# EAGLE schematic untitled (EAGLE 7.2.0)
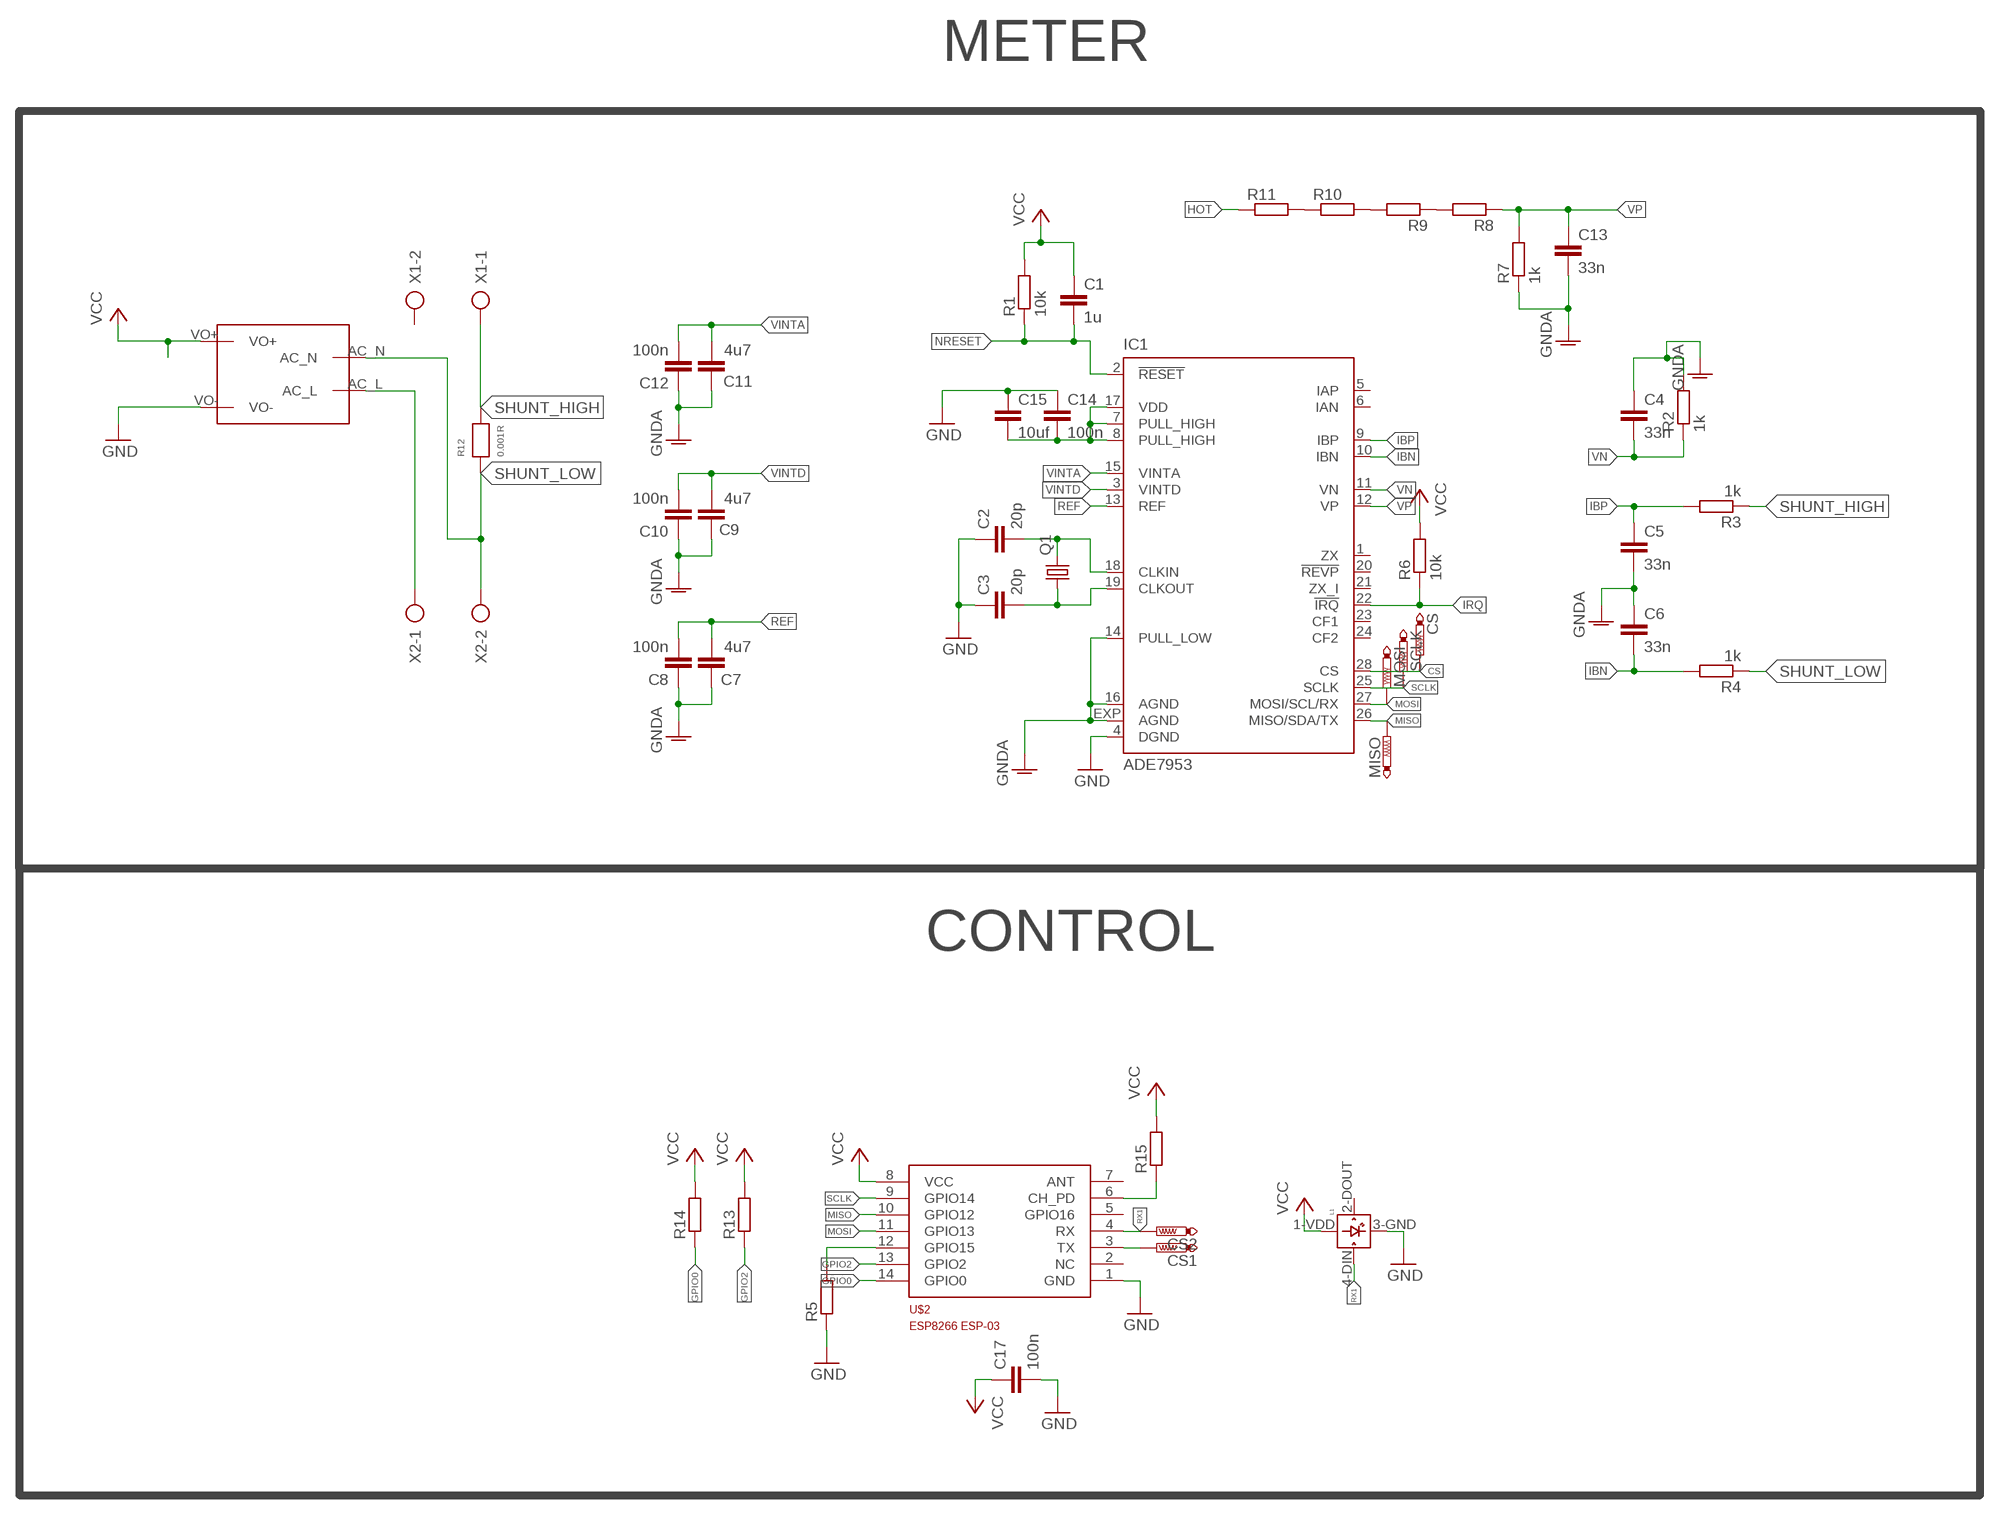
[diagram p0: schematic, sheet 1]

## Parts
C1  1u  C-EUC0805  [C0805]
C2  20p  C-EUC0805  [C0805]
C3  20p  C-EUC0805  [C0805]
C4  33n  C-EUC0805  [C0805]
C5  33n  C-EUC0805  [C0805]
C6  33n  C-EUC0805  [C0805]
C7  4u7  C-EUC0805  [C0805]
C8  100n  C-EUC0805  [C0805]
C9  4u7  C-EUC0805  [C0805]
C10  100n  C-EUC0805  [C0805]
C11  4u7  C-EUC0805  [C0805]
C12  100n  C-EUC0805  [C0805]
C13  33n  C-EUC0805  [C0805]
C14  100n  C-EUC0805  [C0805]
C15  10uf  C-EUC0805  [C0805]
C17  100n  C-EUC0805  [C0805]
CS  PTR1B1,27  [B1,27]
CS1  PTR1B1,27  [B1,27]
CS2  PTR1B1,27  [B1,27]
IC1  ADE7953  [QFN28-ML]
L1  WS2812B  [WS2812B]
MISO  PTR1B1,27  [B1,27]
MOSI  PTR1B1,27  [B1,27]
Q1  CRYSTALHC49UP  [HC49UP]
R1  10k  R-EU_R0805  [R0805]
R2  1k  R-EU_R0805  [R0805]
R3  1k  R-EU_R0805  [R0805]
R4  1k  R-EU_R0805  [R0805]
R5  R-EU_R0603  [R0603]
R6  10k  R-EU_R0805  [R0805]
R7  1k  R-EU_R0805  [R0805]
R8  R-EU_R0805  [R0805]
R9  R-EU_R0805  [R0805]
R10  R-EU_R1206  [R1206]
R11  R-EU_R1206  [R1206]
R12  0.001R  WSR-2_SHUNT  [WRS-2_4527]
R13  R-EU_R0603  [R0603]
R14  R-EU_R0603  [R0603]
R15  R-EU_R0603  [R0603]
SCLK  PTR1B1,27  [B1,27]
U$1  MAINS_CONVERTERS  [HLK-PM01]
U$2  ESP8266_ESP-03  [ESP-03]
X1  AK300/2  [AK300/2]
X2  AK300/2  [AK300/2]

## Nets
CLKIN: C2.2 IC1.18(CLKIN) Q1.2
CLKOUT: C3.2 IC1.19(CLKOUT) Q1.1
CS: CS.TP IC1.28(CS) R5.2 U$2.12(GPIO15)
GND: C2.1 C3.1 C14.1 C15.1 C17.2 IC1.4(DGND) L1.3-GND(GND) R5.1 U$1.VO- U$2.1(GND)
GNDA: C4.1 C5.2 C6.1 C7.1 C8.1 C9.1 C10.1 C11.1 C12.1 C13.2 IC1.14(PULL_LOW) IC1.16(AGND) IC1.EXP(AGND) R2.2 R7.1
GPIO0: R14.1 U$2.14(GPIO0)
GPIO2: R13.1 U$2.13(GPIO2)
HOT: R11.1 U$1.AC_L X2.1
IBN: C6.2 IC1.10(IBN) R4.2
IBP: C5.1 IC1.9(IBP) R3.2
IRQ: IC1.22(!IRQ!) R6.1
MISO: IC1.26(MISO/SDA/TX) MISO.TP U$2.10(GPIO12)
MOSI: IC1.27(MOSI/SCL/RX) MOSI.TP U$2.11(GPIO13)
N$1: R9.2 R10.2
N$2: R10.1 R11.2
N$3: R15.1 U$2.6(CH_PD)
N$12: R8.2 R9.1
NRESET: C1.2 IC1.2(!RESET!) R1.1
REF: C7.2 C8.2 IC1.13(REF)
RX1: CS2.TP L1.4-DIN(DIN) U$2.4(RX)
SCLK: IC1.25(SCLK) SCLK.TP U$2.9(GPIO14)
SHUNT_HIGH: R3.1 R12.2 X1.1
SHUNT_LOW: R4.1 R12.1 U$1.AC_N X2.2
TX1: CS1.TP U$2.3(TX)
VCC: C1.1 C14.2 C15.2 C17.1 IC1.7(PULL_HIGH) IC1.8(PULL_HIGH) IC1.17(VDD) L1.1-VDD(VDD) R1.2 R6.2 R13.2 R14.2 R15.2 U$1.VO+ U$2.8(VCC)
VINTA: C11.2 C12.2 IC1.15(VINTA)
VINTD: C9.2 C10.2 IC1.3(VINTD)
VN: C4.2 IC1.11(VN) R2.1
VP: C13.1 IC1.12(VP) R7.2 R8.1
Unconnected: IC1.1(ZX) IC1.5(IAP) IC1.6(IAN) IC1.20(!REVP!) IC1.21(ZX_I) IC1.23(CF1) IC1.24(CF2) L1.2-DOUT(DOUT) U$2.2(NC) U$2.5(GPIO16) U$2.7(ANT) X1.2

## Notes on the sheet
- METER
- CONTROL

## Library data of the parts
C1-C15 C17 = rcl:C-EU: CAPACITOR, European symbol
CS CS1 CS2 MISO MOSI SCLK = testpad:PTR1: TEST PIN
IC1 = ADE7953:ADE7953: Single Phase, Multifunction Metering IC with Neutral Current Measurement Source: http://www.analog.com/static/imported-files/data_sheets/ADE7953.pdf http://www.analog.com/static/imported-files/jp/data_sheets/ADE7953_jp.pdf
L1 = adafruit:WS2812B
Q1 = adafruit:CRYSTAL: CRYSTAL; OC_FARNELL: unknown; OC_NEWARK: unknown
R1-R11 R13-R15 = rcl:R-EU_: RESISTOR, European symbol
R12 = WSR-2_SHUNT:WSR-2_SHUNT
U$1 = _HLK:MAINS_CONVERTERS
U$2 = ESP8266:ESP8266_ESP-03
X1 X2 = con-ptr500:AK300/2: CONNECTOR; OC_FARNELL: unknown; OC_NEWARK: unknown